# Altium schematic sheet DDR3 Regulators.SchDoc
size A3; SheetNumber: 10; SheetTotal: 12
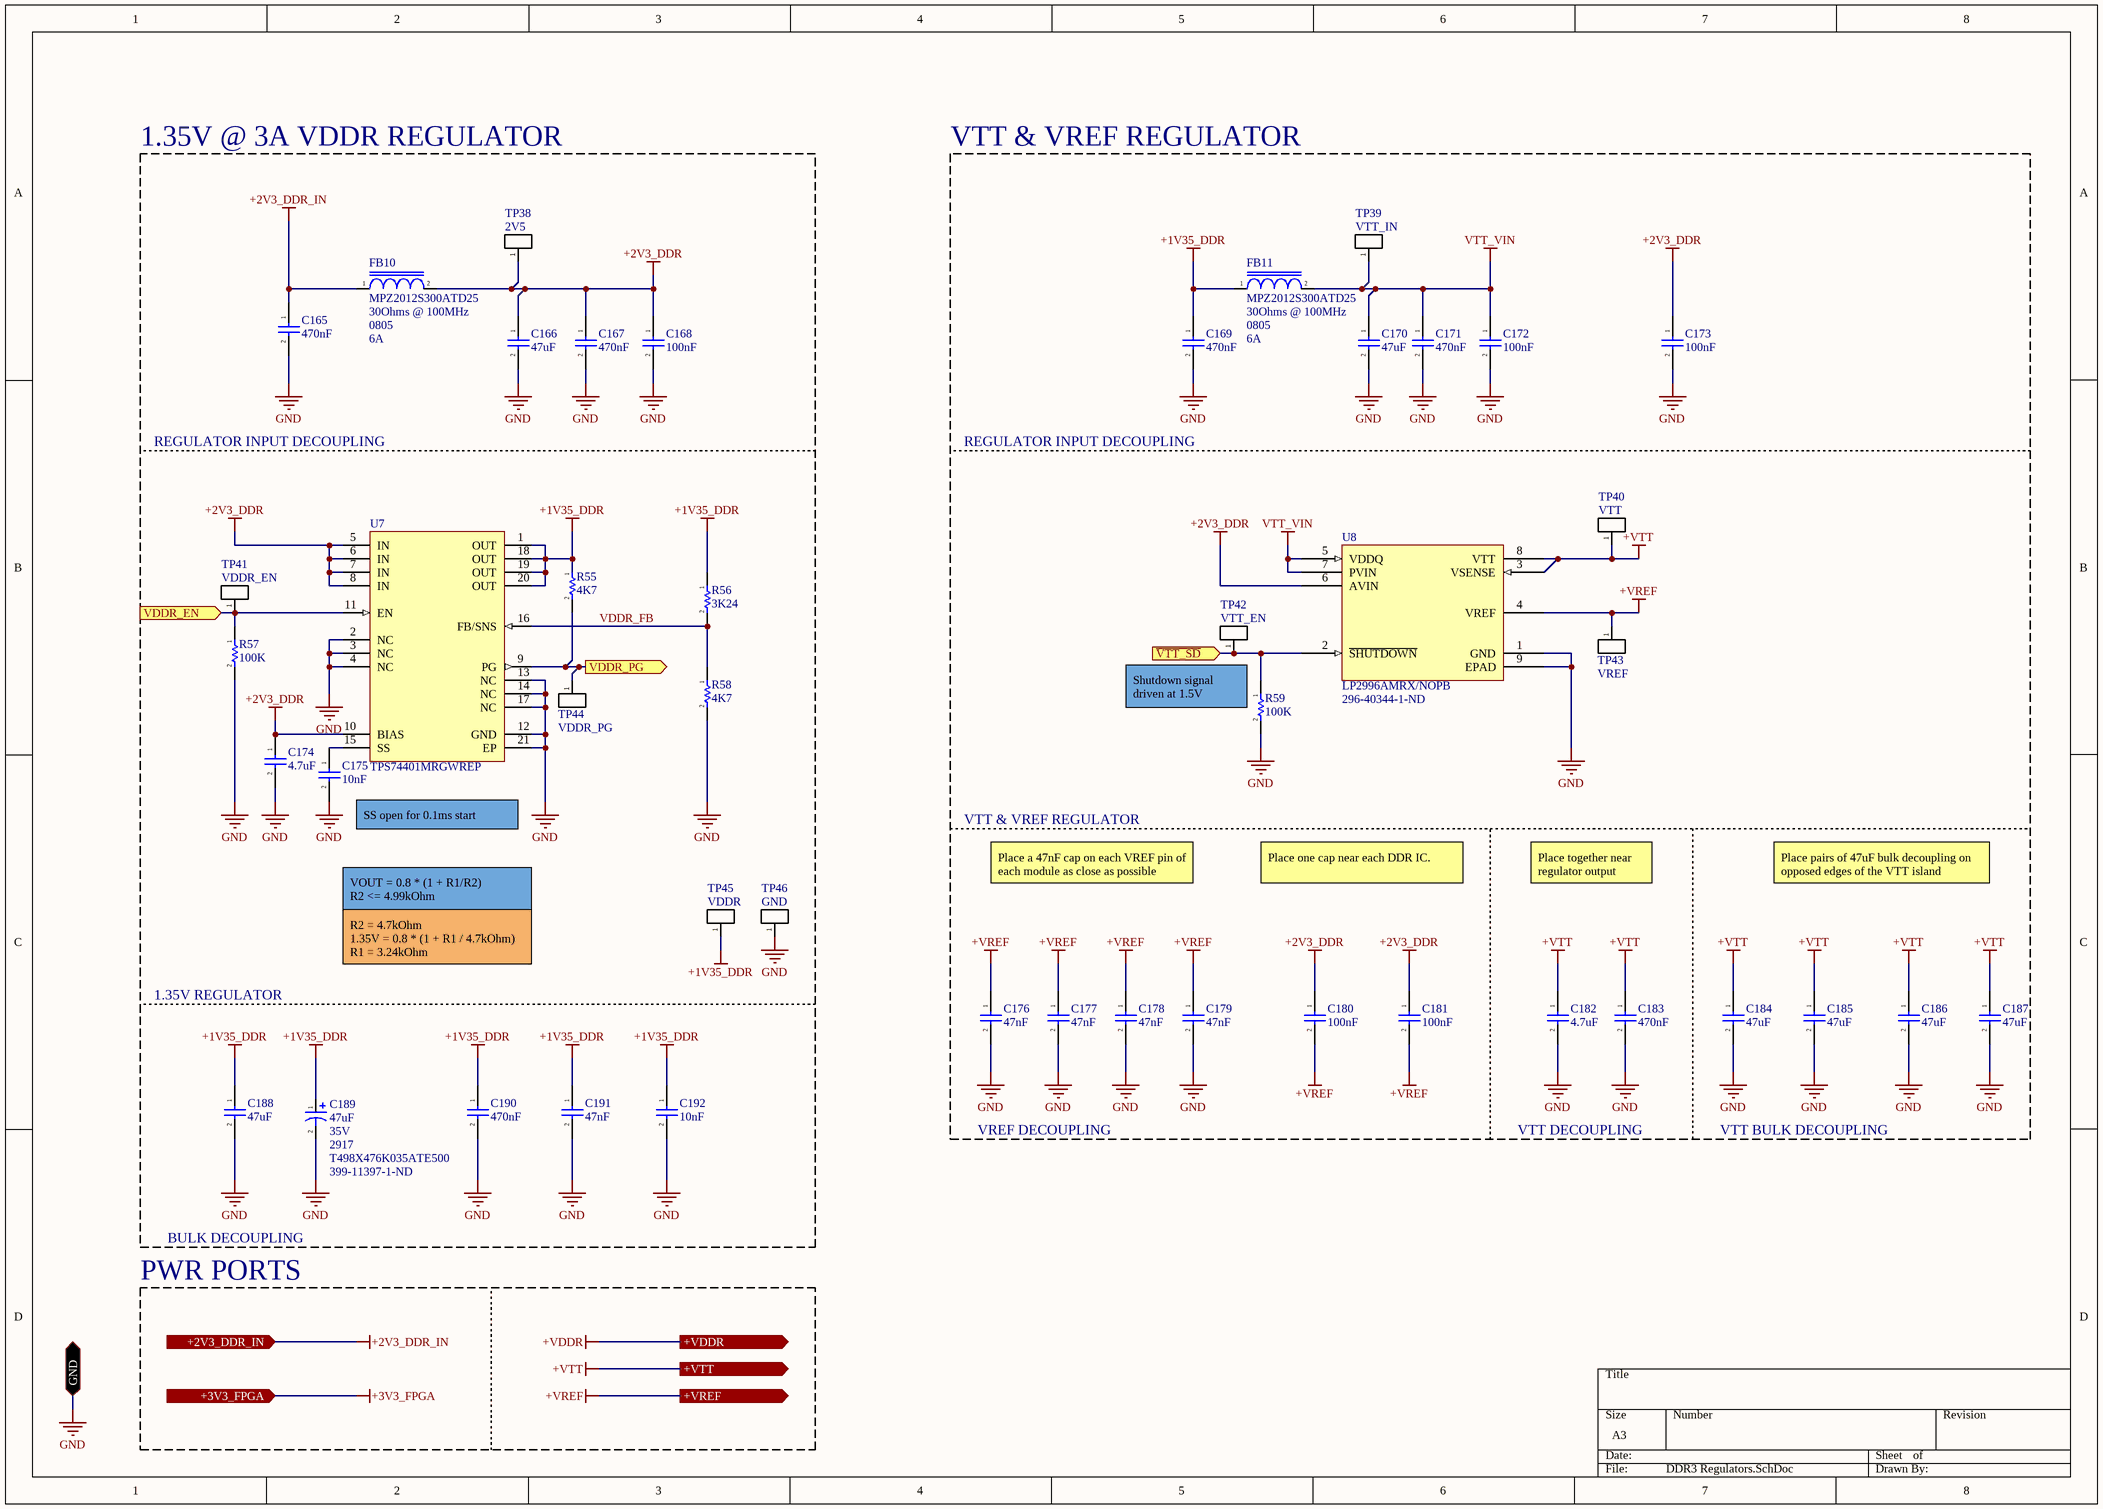
[diagram p0: DDR3 Regulators.SchDoc]

## Parts
C165  470nF  [CAP_0402]
C166  47uF  [CAP_1206]
C167  470nF  [CAP_0402]
C168  100nF  [CAP_0402]
C169  470nF  [CAP_0402]
C170  47uF  [CAP_1206]
C171  470nF  [CAP_0402]
C172  100nF  [CAP_0402]
C173  100nF  [CAP_0402]
C174  4.7uF  [CAP_0805]
C175  10nF  [CAP_0201]
C176  47nF  [CAP_0201]
C177  47nF  [CAP_0201]
C178  47nF  [CAP_0201]
C179  47nF  [CAP_0201]
C180  100nF  [CAP_0402]
C181  100nF  [CAP_0402]
C182  4.7uF  [CAP_0805]
C183  470nF  [CAP_0402]
C184  47uF  [CAP_1206]
C185  47uF  [CAP_1206]
C186  47uF  [CAP_1206]
C187  47uF  [CAP_1206]
C188  47uF  [CAP_1206]
C189  47uF  Part #: T498X476K035ATE500  Rated Voltage: 35V  Supplier Part Number 1: 399-11397-1-ND  Package: 2917  [CAP_2917_P]
C190  470nF  [CAP_0402]
C191  47nF  [CAP_0201]
C192  10nF  [CAP_0201]
FB10  MPZ2012S300ATD25  Impedance @ Freq: 30Ohms @ 100MHz  Package / Case: 0805  Current Rating: 6A  [IND_0805]
FB11  MPZ2012S300ATD25  Impedance @ Freq: 30Ohms @ 100MHz  Package / Case: 0805  Current Rating: 6A  [IND_0805]
R55  4K7  [RES_0603]
R56  3K24  [RES_0603]
R57  100K  [RES_0603]
R58  4K7  [RES_0603]
R59  100K  [RES_0603]
TP38  2V5  [TP_HOLE]  (no BOM)
TP39  VTT_IN  [TP_PAD]  (no BOM)
TP40  VTT  [TP_PAD]  (no BOM)
TP41  VDDR_EN  [TP_PAD_TINY]  (no BOM)
TP42  VTT_EN  [TP_PAD_TINY]  (no BOM)
TP43  VREF  [TP_PAD]  (no BOM)
TP44  VDDR_PG  [TP_PAD_TINY]  (no BOM)
TP45  VDDR  [TP_HOLE]  (no BOM)
TP46  GND  [TP_PAD_SMALL]  (no BOM)
U7  TPS74401MRGWREP  [TPS74401]
U8  LP2996AMRX/NOPB  Supplier Part Number 1: 296-40344-1-ND  [LP2996AMRX]

## Blocks framed on the sheet
1.35V @ 3A VDDR REGULATOR: C165-C168 C174 C175 C188-C192 FB10 R55-R58 TP38 TP41 TP44-TP46 U7
VTT & VREF REGULATOR: C169-C173 C176-C187 FB11 R59 TP39 TP40 TP42 TP43 U8

## Ports
+2V3_DDR_IN (in), +3V3_FPGA (in), +VDDR (out), +VREF (out), +VTT (out), GND (bidir), VDDR_EN (in), VDDR_PG (out), ~{VTT_SD} (in)

## Nets
+1V35_DDR: C169.1 C188.1 C189.1 C190.1 C191.1 C192.1 FB11.1 R55.1 R56.1 TP45.1(A) U7.1(OUT) U7.18(OUT) U7.19(OUT) U7.20(OUT)
+2V3_DDR: C166.1 C167.1 C168.1 C173.1 C174.1 C180.1 C181.1 FB10.2 TP38.1(A) U7.5(IN) U7.6(IN) U7.7(IN) U7.8(IN) U7.10(BIAS) U8.6(AVIN)
+2V3_DDR_IN: C165.1 FB10.1 ; port +2V3_DDR_IN
+3V3_FPGA: port +3V3_FPGA
+VDDR: port +VDDR
+VREF: C176.1 C177.1 C178.1 C179.1 C180.2 C181.2 TP43.1(A) U8.4(VREF) ; port +VREF
+VTT: C182.1 C183.1 C184.1 C185.1 C186.1 C187.1 TP40.1(A) U8.3(VSENSE) U8.8(VTT) ; port +VTT
GND: C165.2 C166.2 C167.2 C168.2 C169.2 C170.2 C171.2 C172.2 C173.2 C174.2 C175.2 C176.2 C177.2 C178.2 C179.2 C182.2 C183.2 C184.2 C185.2 C186.2 C187.2 C188.2 C189.2 C190.2 C191.2 C192.2 R57.2 R58.2 R59.2 TP46.1(A) U7.2(NC) U7.3(NC) U7.4(NC) U7.12(GND) U7.13(NC) U7.14(NC) U7.17(NC) U7.21(EP) U8.1(GND) U8.9(EPAD) ; port GND
VTT_VIN: C170.1 C171.1 C172.1 FB11.2 TP39.1(A) U8.5(VDDQ) U8.7(PVIN)
~{VTT_SD}: R59.1 TP42.1(A) U8.2(~{SHUTDOWN}) ; port ~{VTT_SD}
VDDR_EN: R57.1 TP41.1(A) U7.11(EN) ; port VDDR_EN
VDDR_FB: R56.2 R58.1 U7.16(FB/SNS)
VDDR_PG: R55.2 TP44.1(A) U7.9(PG) ; port VDDR_PG
NetC175_1: C175.1 U7.15(SS)

## Notes on the sheet
- REGULATOR INPUT DECOUPLING
- (near R59) Shutdown signal driven at 1.5V
- (near C175) SS open for 0.1ms start
- VTT & VREF REGULATOR
- VOUT = 0.8 * (1 + R1/R2)
  R2 <= 4.99kOhm
- Place a 47nF cap on each VREF pin of each module as close as possible
- Place one cap near each DDR IC.
- Place together near regulator output
- Place pairs of 47uF bulk decoupling on opposed edges of the VTT island
- R2 = 4.7kOhm
  1.35V = 0.8 * (1 + R1 / 4.7kOhm)
  R1 = 3.24kOhm
- 1.35V REGULATOR
- VREF DECOUPLING
- VTT DECOUPLING
- VTT BULK DECOUPLING
- BULK DECOUPLING
- PWR PORTS

## Library data of the parts
C165-C188 C190-C192 = CAP_CER: Generic SMT Ceramic Capacitor; Voltage - Rated: 25V; Operating Temperature: *; Tolerance: *; Mfr: *; ComponentLink1Description: Digikey; ComponentLink1URL: [Digikey Link]; Digikey Part No: *; ComponentLink2Description: Datasheet; ComponentLink2URL: [Datasheet Link]
  C165 C167-C169 C171-C173 C180 C181 C183 C190: Footprint: 0402
  C166 C170 C184-C188: Footprint: 1206
  C174 C182: Footprint: 0805
  C175-C179 C191 C192: Footprint: 0201
C189 = CAP_T498X476K035ATE500: 47 µF Molded Tantalum Capacitors 35 V 2917 (7343 Metric) 500mOhm; Mfr: KEMET; Tolerance: 10%; Operating Temperature: -55C - 150C; Supplier 1: Digi-Key
FB10 FB11 = IND_MPZ2012S300ATD25: 30 Ohms @ 100 MHz 1 Power Line Ferrite Bead 0805 (2012 Metric) 6A 10mOhm; Resistance: 10mOhms; Operating Temperature: -55C - 125C; Rating: AEC-Q200
R55 R57-R59 = RESISTOR: Power: 1/16W; Tolerance: 10%; Automotive: *; Operating Temperature: *; # Digikey: *; ComponentLink1Description: Digikey; ComponentLink1URL: *; # Manufacturer: *; Package / Case: 0603
R56 = RESISTOR: Power: 1/16W; Tolerance: 2%; Automotive: *; Operating Temperature: *; # Digikey: *; ComponentLink1Description: Digikey; ComponentLink1URL: *; # Manufacturer: *; Package / Case: 0603
TP38-TP46 = TESTPOINT: Test Point
U7 = IC_TPS47701: IC REG LINEAR POS ADJ 3A 20VQFN; Mfr: Texas Instruments; Input Voltage (min): 240mV; Input Voltage (max): 5.5V; Output Voltage (min): 0.8V; Output Voltage (max): 3.6V; PSRR: 73dB - 50dB; Current: 3A; Operating Temperature: -55C - 125C; Package / Case: 20-VQFN; Digikey Part Number: 296-27227-1-ND; Voltage Dropout (max): 240mV; ComponentLink1Description: Digikey; ComponentLink1URL: https://www.digikey.ca/en/products/detail/texas-instruments/TPS74401MRGWREP/2261531; ComponentLink2Description: Datasheet; ComponentLink2URL: https://www.ti.com/lit/ds/symlink/tps74401-ep.pdf
U8 = IC_LP2996AMRX: IC REGULATOR DDR TERM 8SOPWRPAD; Mfr: Texas Instruments; Supply Voltage: 2.2V - 5.5V; Continuous Current: 1.5A; Applications: DDR3 Terminator; Operating Temperature: 0C - 125C; Supplier 1: Digi-Key